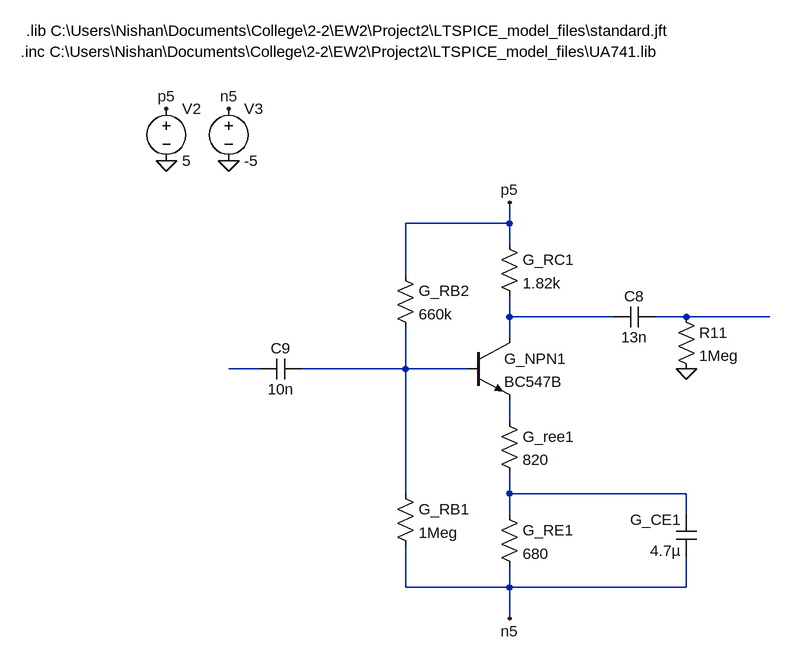
[diagram p0: schematic Gain.asc]
Gain.asc, the LTspice schematic file:
Version 4.1
SHEET 1 4496 2220
WIRE 544 336 544 304
WIRE 544 336 384 336
WIRE 544 368 544 336
WIRE 384 416 384 336
WIRE 544 480 544 448
WIRE 704 480 544 480
WIRE 816 480 768 480
WIRE 944 480 816 480
WIRE 544 512 544 480
WIRE 160 560 112 560
WIRE 384 560 384 496
WIRE 384 560 224 560
WIRE 480 560 384 560
WIRE 544 640 544 608
WIRE 384 752 384 560
WIRE 544 752 544 720
WIRE 816 752 544 752
WIRE 544 784 544 752
WIRE 816 784 816 752
WIRE 384 896 384 832
WIRE 544 896 544 864
WIRE 544 896 384 896
WIRE 816 896 816 848
WIRE 816 896 544 896
WIRE 544 944 544 896
FLAG 16 240 0
FLAG 112 240 0
FLAG 16 160 p5
FLAG 112 160 n5
FLAG 544 944 n5
FLAG 544 304 p5
FLAG 816 560 0
DATAFLAG 320 560 ""
DATAFLAG 640 480 ""
SYMBOL voltage 16 144 R0
WINDOW 123 0 0 Left 0
WINDOW 39 0 0 Left 0
SYMATTR InstName V2
SYMATTR Value 5
SYMBOL voltage 112 144 R0
WINDOW 123 0 0 Left 0
WINDOW 39 0 0 Left 0
SYMATTR InstName V3
SYMATTR Value -5
SYMBOL res 368 736 R0
SYMATTR InstName G_RB1
SYMATTR Value 1Meg
SYMBOL res 368 400 R0
SYMATTR InstName G_RB2
SYMATTR Value 660k
SYMBOL npn 480 512 R0
SYMATTR InstName G_NPN1
SYMATTR Value BC547B
SYMBOL res 528 352 R0
SYMATTR InstName G_RC1
SYMATTR Value 1.82k
SYMBOL res 528 768 R0
SYMATTR InstName G_RE1
SYMATTR Value 680
SYMBOL res 528 624 R0
SYMATTR InstName G_ree1
SYMATTR Value 820
SYMBOL cap 832 848 R180
WINDOW 0 24 56 Left 2
WINDOW 3 24 8 Left 2
SYMATTR InstName G_CE1
SYMATTR Value 4.7µ
SYMBOL cap 768 464 R90
WINDOW 0 0 32 VBottom 2
WINDOW 3 32 32 VTop 2
SYMATTR InstName C8
SYMATTR Value 13n
SYMBOL res 800 464 R0
SYMATTR InstName R11
SYMATTR Value 1Meg
SYMBOL cap 224 544 R90
WINDOW 0 0 32 VBottom 2
WINDOW 3 32 32 VTop 2
SYMATTR InstName C9
SYMATTR Value 10n
TEXT -200 40 Left 2 !.lib C:\\Users\\Nishan\\Documents\\College\\2-2\\EW2\\Project2\\LTSPICE_model_files\\standard.jft
TEXT -208 72 Left 2 !.inc C:\\Users\\Nishan\\Documents\\College\\2-2\\EW2\\Project2\\LTSPICE_model_files\\UA741.lib

The netlist it stands for:
* Gain.asc
V2 p5 0 5
V3 n5 0 -5
R§G_RB1 N004 n5 1Meg
R§G_RB2 p5 N004 660k
Q§G_NPN1 N001 N004 N005 0 BC547B
R§G_RC1 p5 N001 1.82k
R§G_RE1 N006 n5 680
R§G_ree1 N005 N006 820
C§G_CE1 n5 N006 4.7µ
C8 N002 N001 13n
R11 N002 0 1Meg
C9 N004 N003 10n
.model NPN NPN
.model PNP PNP
.lib standard.bjt
.lib C:\Users\Nishan\Documents\College\2-2\EW2\Project2\LTSPICE_model_files\standard.jft
.inc C:\Users\Nishan\Documents\College\2-2\EW2\Project2\LTSPICE_model_files\UA741.lib
.backanno
.end